# Altium schematic sheet backup.SchDoc
size A4
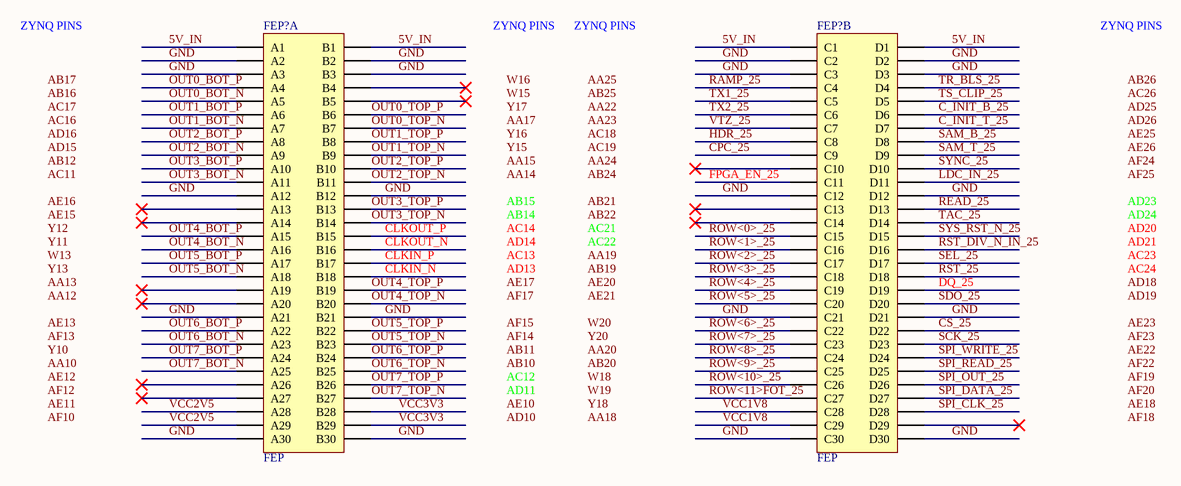
[diagram p0: backup.SchDoc]

## Parts
(Parts that share a designator on the sheet are numbered #1, #2 ... from top to bottom, then left to right.)
FEP?#1  FEP  [FEP-X2]  (part A of 3)
FEP?#2  FEP  [FEP-X2]  (part B of 3)

## Nets
5V_IN: FEP?#1.A1 FEP?#1.B1 FEP?#2.C1 FEP?#2.D1
C_INIT_B_25: FEP?#2.D6
C_INIT_T_25: FEP?#2.D7
CLKIN_N: FEP?#1.B18
CLKIN_P: FEP?#1.B17
CLKOUT_N: FEP?#1.B16
CLKOUT_P: FEP?#1.B15
CPC_25: FEP?#2.C9
CS_25: FEP?#2.D22
DQ_25: FEP?#2.D19
FPGA_EN_25: FEP?#2.C11
GND: FEP?#1.A2 FEP?#1.A3 FEP?#1.A12 FEP?#1.A21 FEP?#1.A30 FEP?#1.B2 FEP?#1.B3 FEP?#1.B12 FEP?#1.B21 FEP?#1.B30 FEP?#2.C2 FEP?#2.C3 FEP?#2.C12 FEP?#2.C21 FEP?#2.C30 FEP?#2.D2 FEP?#2.D3 FEP?#2.D12 FEP?#2.D21 FEP?#2.D30
HDR_25: FEP?#2.C8
LDC_IN_25: FEP?#2.D11
OUT0_BOT_N: FEP?#1.A5
OUT0_BOT_P: FEP?#1.A4
OUT0_TOP_N: FEP?#1.B7
OUT0_TOP_P: FEP?#1.B6
OUT1_BOT_N: FEP?#1.A7
OUT1_BOT_P: FEP?#1.A6
OUT1_TOP_N: FEP?#1.B9
OUT1_TOP_P: FEP?#1.B8
OUT2_BOT_N: FEP?#1.A9
OUT2_BOT_P: FEP?#1.A8
OUT2_TOP_N: FEP?#1.B11
OUT2_TOP_P: FEP?#1.B10
OUT3_BOT_N: FEP?#1.A11
OUT3_BOT_P: FEP?#1.A10
OUT3_TOP_N: FEP?#1.B14
OUT3_TOP_P: FEP?#1.B13
OUT4_BOT_N: FEP?#1.A16
OUT4_BOT_P: FEP?#1.A15
OUT4_TOP_N: FEP?#1.B20
OUT4_TOP_P: FEP?#1.B19
OUT5_BOT_N: FEP?#1.A18
OUT5_BOT_P: FEP?#1.A17
OUT5_TOP_N: FEP?#1.B23
OUT5_TOP_P: FEP?#1.B22
OUT6_BOT_N: FEP?#1.A23
OUT6_BOT_P: FEP?#1.A22
OUT6_TOP_N: FEP?#1.B25
OUT6_TOP_P: FEP?#1.B24
OUT7_BOT_N: FEP?#1.A25
OUT7_BOT_P: FEP?#1.A24
OUT7_TOP_N: FEP?#1.B27
OUT7_TOP_P: FEP?#1.B26
RAMP_25: FEP?#2.C4
READ_25: FEP?#2.D13
ROW<0>_25: FEP?#2.C15
ROW<1>_25: FEP?#2.C16
ROW<2>_25: FEP?#2.C17
ROW<3>_25: FEP?#2.C18
ROW<4>_25: FEP?#2.C19
ROW<5>_25: FEP?#2.C20
ROW<6>_25: FEP?#2.C22
ROW<7>_25: FEP?#2.C23
ROW<8>_25: FEP?#2.C24
ROW<9>_25: FEP?#2.C25
ROW<10>_25: FEP?#2.C26
ROW<11>FOT_25: FEP?#2.C27
RST_25: FEP?#2.D18
RST_DIV_N_IN_25: FEP?#2.D16
SAM_B_25: FEP?#2.D8
SAM_T_25: FEP?#2.D9
SCK_25: FEP?#2.D23
SDO_25: FEP?#2.D20
SEL_25: FEP?#2.D17
SPI_CLK_25: FEP?#2.D28
SPI_DATA_25: FEP?#2.D27
SPI_OUT_25: FEP?#2.D26
SPI_READ_25: FEP?#2.D25
SPI_WRITE_25: FEP?#2.D24
SYNC_25: FEP?#2.D10
SYS_RST_N_25: FEP?#2.D15
TAC_25: FEP?#2.D14
TR_BLS_25: FEP?#2.D4
TS_CLIP_25: FEP?#2.D5
TX1_25: FEP?#2.C5
TX2_25: FEP?#2.C6
VCC1V8: FEP?#2.C28 FEP?#2.C29
VCC2V5: FEP?#1.A28 FEP?#1.A29
VCC3V3: FEP?#1.B28 FEP?#1.B29
VTZ_25: FEP?#2.C7

Not connected (* = marked no-connect by the designer): FEP?#1 A13* A14* A19* A20* A26* A27* B4* B5*; FEP?#2 C10* C13* C14* D29*

## Notes on the sheet
- Labels drawn without touching a wire or pin: AA10, AA12, AA13, AA14, AA15, AA17, AA18, AA19, AA20, AA22, AA23, AA24, AA25, AB10, AB11, AB12, AB14, AB15, AB16, AB17, AB19, AB20, AB21, AB22, AB24, AB25, AB26, AC11, AC12, AC13, AC14, AC16, AC17, AC18, AC19, AC21, AC22, AC23, AC24, AC26, AD10, AD11, AD13, AD14, AD15, AD16, AD18, AD19, AD20, AD21, AD23, AD24, AD25, AD26, AE10, AE11, AE12, AE13, AE15, AE16, AE17, AE18, AE20, AE21, AE22, AE23, AE25, AE26, AF10, AF12, AF13, AF14, AF15, AF17, AF18, AF19, AF20, AF22, AF23, AF24, AF25, W13, W15, W16, W18, W19, W20, Y10, Y11, Y12, Y13, Y15, Y16, Y17, Y18, Y20, ZYNQ PINS

## Library data of the parts
FEP?#1 FEP?#2 = FEP-2X